# Altium schematic sheet crw_drive.SchDoc
size A
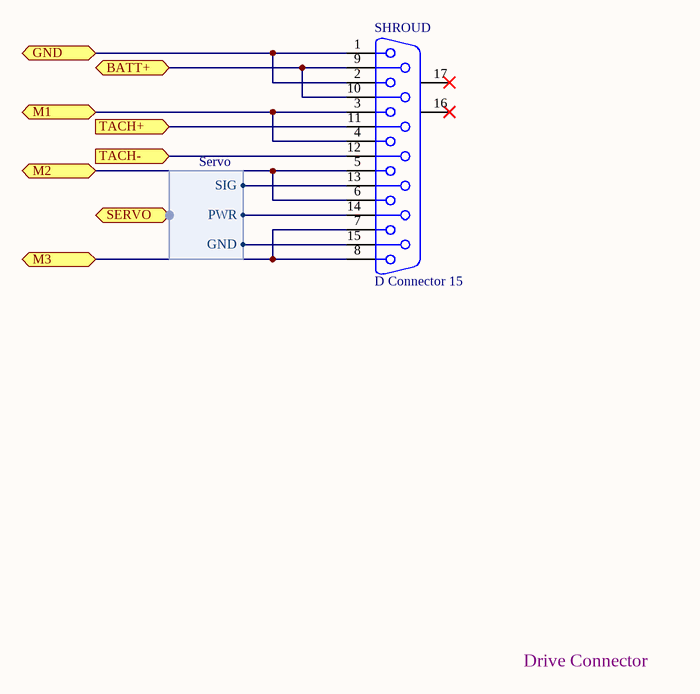
[diagram p0: crw_drive.SchDoc]

## Parts
SHROUD  D Connector 15  [DSUB1.385-2H15]

## Ports
BATT+, GND, M1, M2, M3, SERVO (harness Servo), TACH+ (in), TACH- (in)

## Harnesses
Servo: SIG, PWR, GND

## Nets
BATT+: SHROUD.9 SHROUD.10 ; port BATT+
GND: SHROUD.1 SHROUD.2 ; port GND
M1: SHROUD.3 SHROUD.4 ; port M1
M2: SHROUD.5 SHROUD.6 ; port M2
M3: SHROUD.7 SHROUD.8 ; port M3
TACH+: SHROUD.11 ; port TACH+
TACH-: SHROUD.12 ; port TACH-
NetSHROUD_13: SHROUD.13 ; port SERVO.SIG
NetSHROUD_14: SHROUD.14 ; port SERVO.PWR
NetSHROUD_15: SHROUD.15 ; port SERVO.GND

Not connected (* = marked no-connect by the designer): SHROUD 16(MH1)* 17(MH2)*

## Notes on the sheet
- Drive Connector

## Library data of the parts
SHROUD = D Connector 15: Receptacle Assembly, 15 Position, Right Angle; PackageDocument: O; Positions: 15; Published: 15-Jun-2001; LatestRevisionDate: 17-Jul-2002; LatestRevisionNote: Re-released for DXP Platform.; DatasheetDocument: 1-Sep-99; PackageReference: 788757; Publisher: Altium Limited; Orientation: Right Angle; Gender: Receptacle